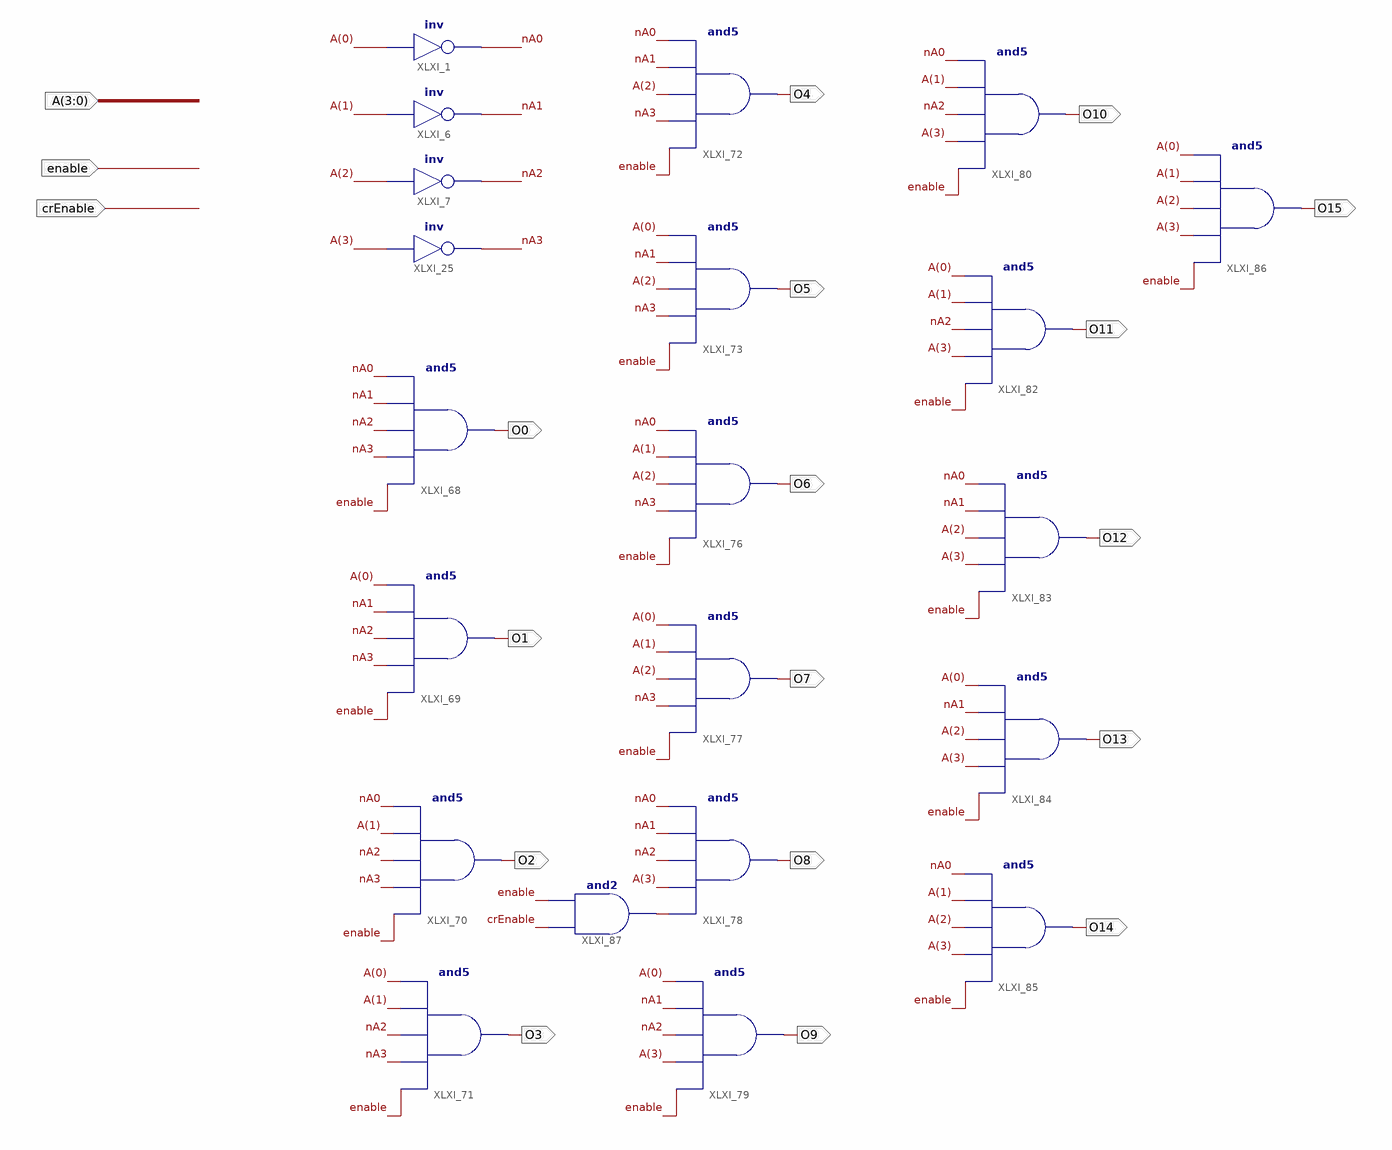
[diagram p0: schematic sheet 1]
// Xilinx ISE schematic decode5b16.sch (spartan3adsp) as structural Verilog: 21 symbols, 19 ports
module decode5b16 (
  input  [3:0] A,
  input  enable,
  input  crEnable,
  output O0,
  output O1,
  output O2,
  output O3,
  output O9,
  output O8,
  output O7,
  output O6,
  output O5,
  output O4,
  output O10,
  output O11,
  output O12,
  output O13,
  output O14,
  output O15
);

  wire nA0, nA1, nA2, nA3, XLXN_2;

  not XLXI_1 (nA0, A[0]);
  not XLXI_6 (nA1, A[1]);
  not XLXI_7 (nA2, A[2]);
  not XLXI_25 (nA3, A[3]);
  and XLXI_68 (O0, enable, nA3, nA2, nA1, nA0);
  and XLXI_69 (O1, enable, nA3, nA2, nA1, A[0]);
  and XLXI_70 (O2, enable, nA3, nA2, A[1], nA0);
  and XLXI_71 (O3, enable, nA3, nA2, A[1], A[0]);
  and XLXI_72 (O4, enable, nA3, A[2], nA1, nA0);
  and XLXI_73 (O5, enable, nA3, A[2], nA1, A[0]);
  and XLXI_76 (O6, enable, nA3, A[2], A[1], nA0);
  and XLXI_77 (O7, enable, nA3, A[2], A[1], A[0]);
  and XLXI_78 (O8, XLXN_2, A[3], nA2, nA1, nA0);
  and XLXI_79 (O9, enable, A[3], nA2, nA1, A[0]);
  and XLXI_80 (O10, enable, A[3], nA2, A[1], nA0);
  and XLXI_82 (O11, enable, A[3], nA2, A[1], A[0]);
  and XLXI_83 (O12, enable, A[3], A[2], nA1, nA0);
  and XLXI_84 (O13, enable, A[3], A[2], nA1, A[0]);
  and XLXI_85 (O14, enable, A[3], A[2], A[1], nA0);
  and XLXI_86 (O15, enable, A[3], A[2], A[1], A[0]);
  and XLXI_87 (XLXN_2, crEnable, enable);
endmodule
